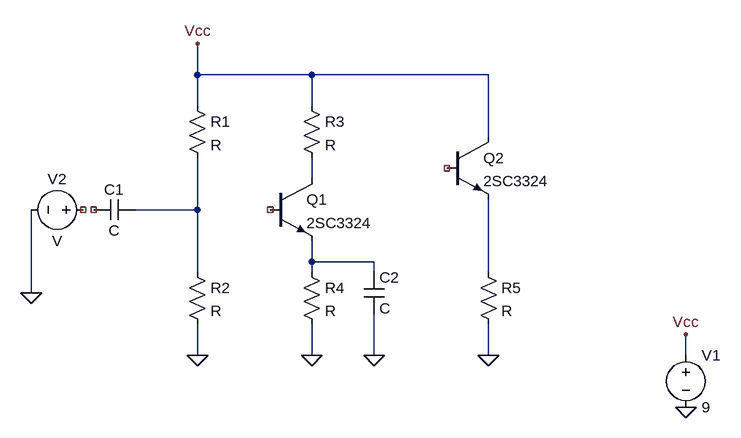
[diagram p0: schematic Draft1.asc]
Draft1.asc, the LTspice schematic file:
Version 4
SHEET 1 900 680
WIRE 80 -80 80 -128
WIRE 256 -80 80 -80
WIRE 528 -80 256 -80
WIRE 80 -32 80 -80
WIRE 256 -32 256 -80
WIRE 528 16 528 -80
WIRE 256 80 256 48
WIRE 80 128 80 48
WIRE 80 128 -16 128
WIRE 256 208 256 176
WIRE 352 208 256 208
WIRE 80 224 80 128
WIRE 256 224 256 208
WIRE 352 224 352 208
WIRE 528 224 528 112
WIRE -176 256 -176 128
WIRE 80 352 80 304
WIRE 256 352 256 304
WIRE 352 352 352 288
WIRE 528 352 528 304
WIRE 832 352 832 320
FLAG 832 432 0
FLAG 832 320 Vcc
FLAG 80 352 0
FLAG 256 352 0
FLAG 528 352 0
FLAG 352 352 0
FLAG -176 256 0
FLAG 80 -128 Vcc
SYMBOL cap -16 112 R90
WINDOW 0 0 32 VBottom 2
WINDOW 3 32 32 VTop 2
SYMATTR InstName C1
SYMBOL res 64 -48 R0
SYMATTR InstName R1
SYMBOL res 64 208 R0
SYMATTR InstName R2
SYMBOL npn 192 80 R0
SYMATTR InstName Q1
SYMATTR Value 2SC3324
SYMBOL res 240 -48 R0
SYMATTR InstName R3
SYMBOL res 240 208 R0
SYMATTR InstName R4
SYMBOL npn 464 16 R0
SYMATTR InstName Q2
SYMATTR Value 2SC3324
SYMBOL cap 336 224 R0
SYMATTR InstName C2
SYMBOL res 512 208 R0
SYMATTR InstName R5
SYMBOL voltage 832 336 R0
WINDOW 123 0 0 Left 0
WINDOW 39 0 0 Left 0
SYMATTR InstName V1
SYMATTR Value 9
SYMBOL voltage -80 128 R90
WINDOW 0 -32 56 VBottom 2
WINDOW 3 32 56 VTop 2
SYMATTR InstName V2

The netlist it stands for:
* Draft1.asc
C1 N002 NC_01 C
R1 Vcc N002 R
R2 N002 0 R
Q1 N001 NC_02 N003 0 2SC3324
R3 Vcc N001 R
R4 N003 0 R
Q2 Vcc NC_03 N004 0 2SC3324
C2 N003 0 C
R5 N004 0 R
V1 Vcc 0 9
V2 NC_04 0 V
.model NPN NPN
.model PNP PNP
.lib standard.bjt
.backanno
.end